# EAGLE schematic 00A-050 (EAGLE 6.3)
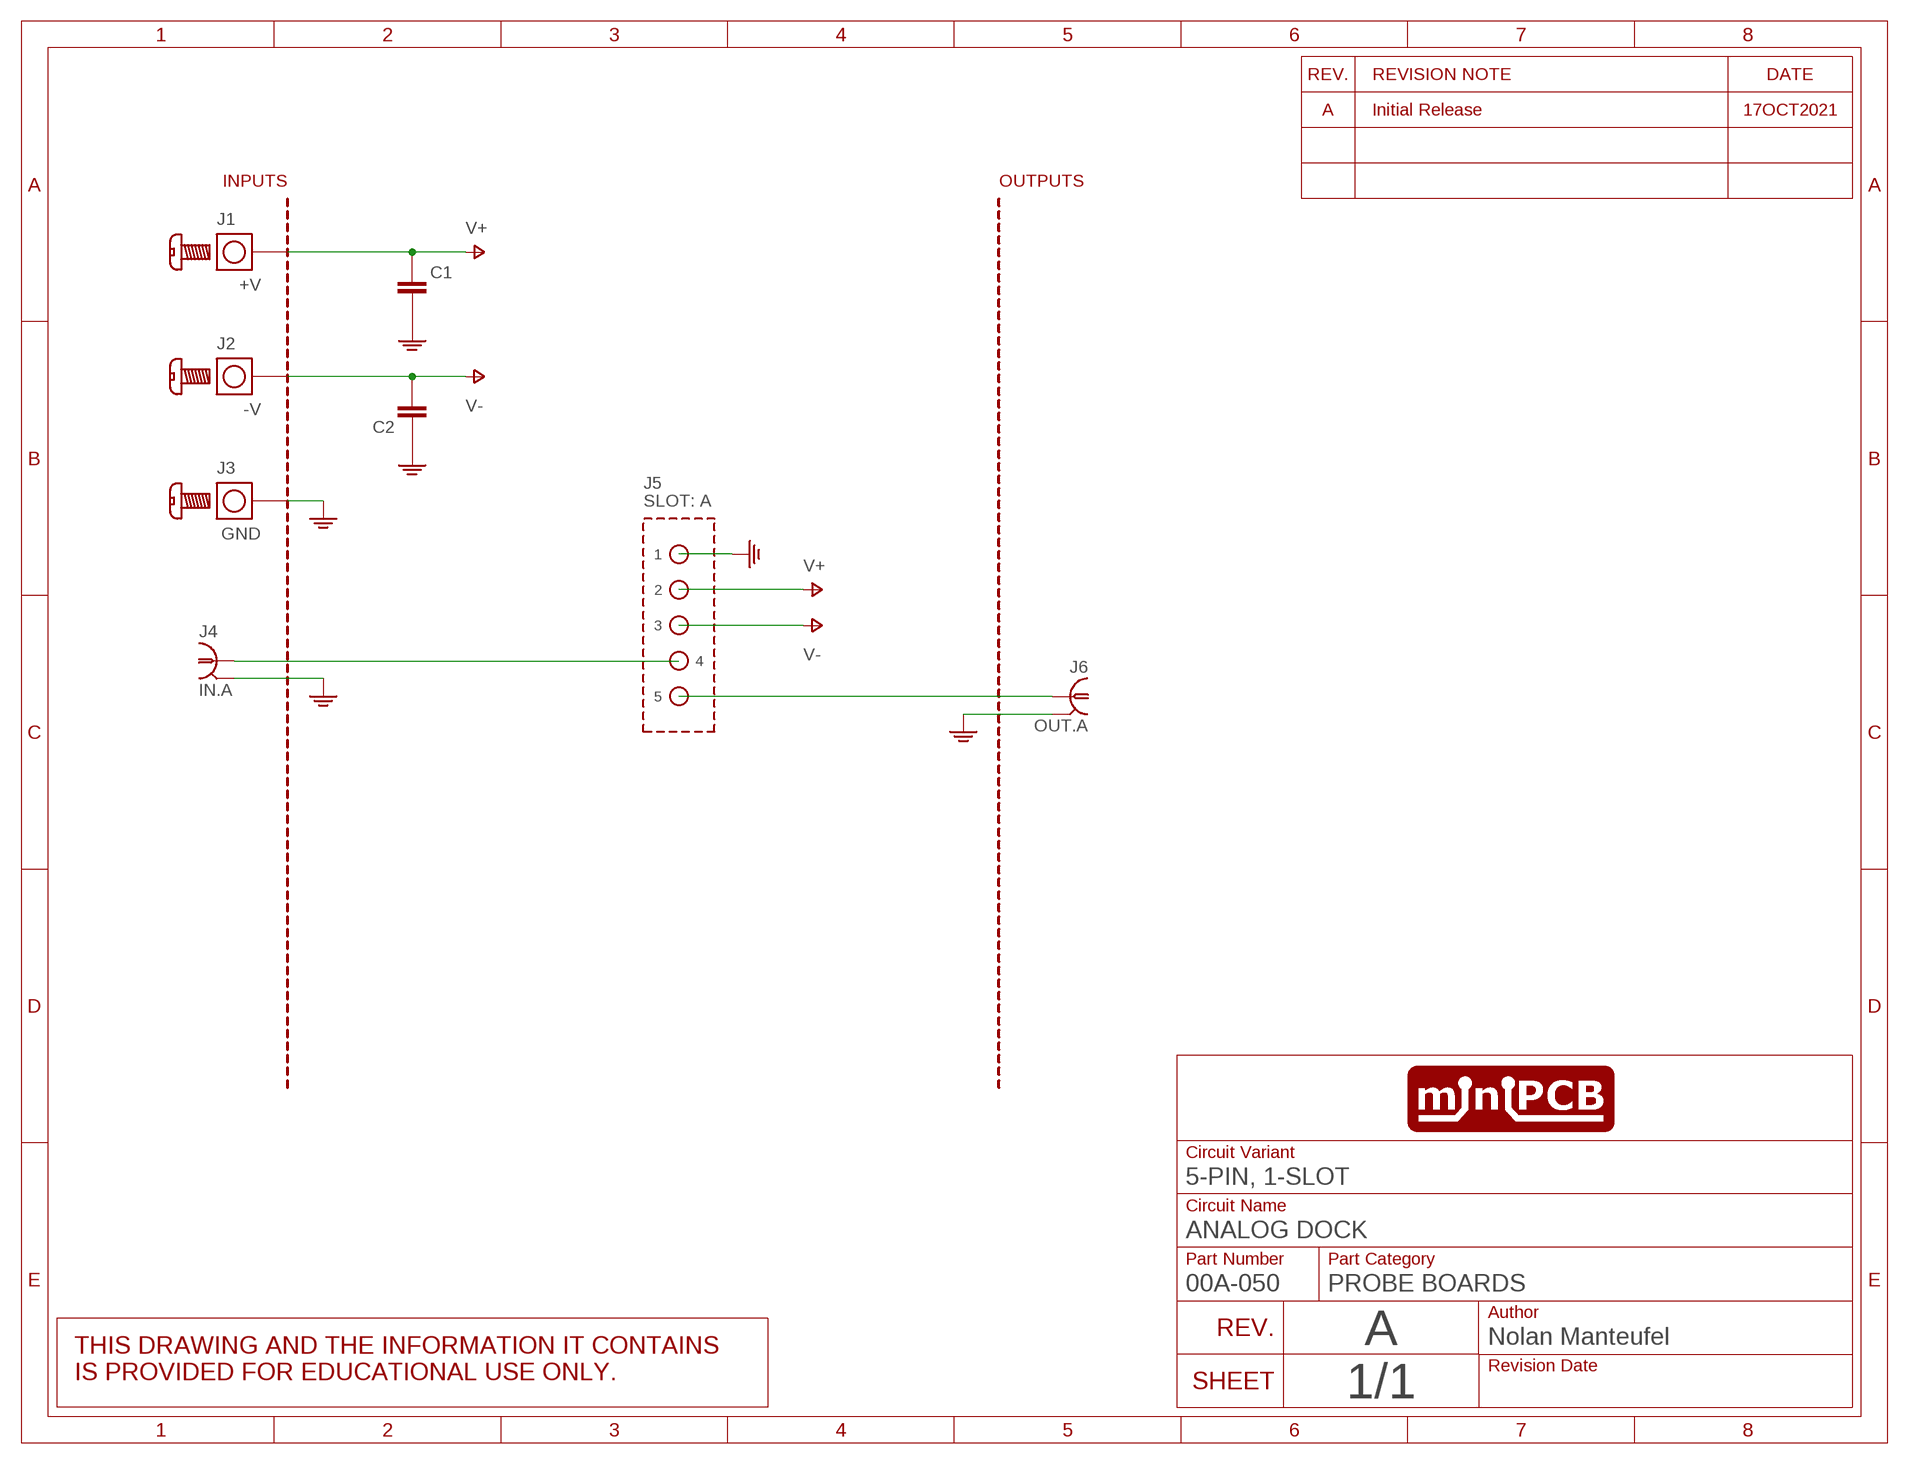
[diagram p0: schematic, sheet 1]
SHEET1 (SCHEMATIC): CIRCUIT_CATEGORY: PROBE BOARDS; CIRCUIT_NAME: ANALOG DOCK; REVISION: A

## Parts
C1  CAPACITOR_10  [C5MM]
C2  CAPACITOR_10  [C5MM]
J1  +V  SCREW-TERMINAL  [SCREW-TERMINAL-M3]
J2  -V  SCREW-TERMINAL  [SCREW-TERMINAL-M3]
J3  GND  SCREW-TERMINAL  [SCREW-TERMINAL-M3]
J4  IN.A  BNC_35N14  [B35N14H]
J5  SLOT: A  MINIPCB_DOCK_5P_5P  [MINIPCB_DOCK_5P]
J6  OUT.A  BNC_35N14  [B35N14H]
PCB  MINIPCB_0PDOCK_50X100  [MINIPCB_DOCK_50X100]

## Nets
GND: C1.- C2.+ J3.1 J3.2 J3.3 J3.4 J4.2.GND(GND) J4.3.GND(GND) J4.4.GND(GND) J4.5.GND(GND) J5.1 J6.2.GND(GND) J6.3.GND(GND) J6.4.GND(GND) J6.5.GND(GND)
N$1: J4.1.SIG J5.4
N$2: J5.5 J6.1.SIG
V+: C1.+ J1.1 J1.2 J1.3 J1.4 J5.2
V-: C2.- J2.1 J2.2 J2.3 J2.4 J5.3

## Notes on the sheet
- 17OCT2021

## Library data of the parts
C1 C2 = minipcb:CAPACITOR
J1-J3 = minipcb:SCREW-TERMINAL
J4 J6 = minipcb:BNC
J5 = minipcb:MINIPCB_DOCK_5P; SLOT: A
PCB = minipcb:MINIPCB_0P; PART_NUMBER: 00A-050; REVISION: A